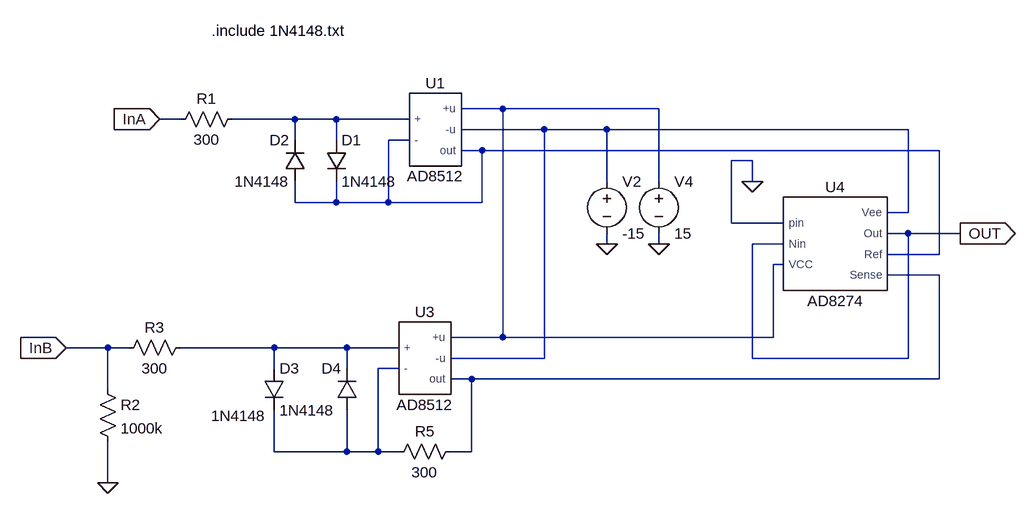
[diagram p0: schematic BufH.asc]
BufH.asc, the LTspice schematic file:
Version 4
SHEET 1 3012 1016
WIRE -256 -464 -320 -464
WIRE -16 -464 -256 -464
WIRE -752 -448 -784 -448
WIRE -576 -448 -672 -448
WIRE -512 -448 -576 -448
WIRE -400 -448 -512 -448
WIRE -192 -432 -320 -432
WIRE -96 -432 -192 -432
WIRE 368 -432 -96 -432
WIRE -576 -416 -576 -448
WIRE -512 -416 -512 -448
WIRE -400 -416 -432 -416
WIRE -288 -400 -320 -400
WIRE 416 -400 -288 -400
WIRE 128 -384 96 -384
WIRE -96 -352 -96 -432
WIRE -16 -352 -16 -464
WIRE 128 -352 128 -384
WIRE -576 -320 -576 -352
WIRE -512 -320 -512 -352
WIRE -512 -320 -576 -320
WIRE -432 -320 -432 -416
WIRE -432 -320 -512 -320
WIRE -288 -320 -288 -400
WIRE -288 -320 -432 -320
WIRE 368 -304 368 -432
WIRE 368 -304 336 -304
WIRE 96 -288 96 -384
WIRE 176 -288 96 -288
WIRE 368 -272 336 -272
WIRE 448 -272 368 -272
WIRE -96 -256 -96 -272
WIRE -16 -256 -16 -272
WIRE 176 -256 128 -256
WIRE 416 -240 416 -400
WIRE 416 -240 336 -240
WIRE 176 -224 160 -224
WIRE 416 -208 336 -208
WIRE -256 -112 -256 -464
WIRE -256 -112 -336 -112
WIRE 160 -112 160 -224
WIRE 160 -112 -256 -112
WIRE -864 -96 -928 -96
WIRE -832 -96 -864 -96
WIRE -608 -96 -752 -96
WIRE -496 -96 -608 -96
WIRE -416 -96 -496 -96
WIRE -192 -80 -192 -432
WIRE -192 -80 -336 -80
WIRE 128 -80 128 -256
WIRE 368 -80 368 -272
WIRE 368 -80 128 -80
WIRE -608 -64 -608 -96
WIRE -496 -64 -496 -96
WIRE -416 -64 -448 -64
WIRE -304 -48 -336 -48
WIRE 416 -48 416 -208
WIRE 416 -48 -304 -48
WIRE -864 -32 -864 -96
WIRE -608 64 -608 0
WIRE -496 64 -496 0
WIRE -496 64 -608 64
WIRE -448 64 -448 -64
WIRE -448 64 -496 64
WIRE -416 64 -448 64
WIRE -304 64 -304 -48
WIRE -304 64 -336 64
WIRE -864 112 -864 48
FLAG -96 -256 0
FLAG -16 -256 0
FLAG -784 -448 InA
IOPIN -784 -448 In
FLAG -928 -96 InB
IOPIN -928 -96 In
FLAG 448 -272 OUT
IOPIN 448 -272 Out
FLAG -864 112 0
FLAG 128 -352 0
SYMBOL AD8512 -368 -432 R0
SYMATTR InstName U1
SYMBOL voltage -16 -368 R0
WINDOW 123 0 0 Left 0
WINDOW 39 0 0 Left 0
SYMATTR InstName V4
SYMATTR Value 15
SYMBOL AD8512 -384 -80 R0
SYMATTR InstName U3
SYMBOL voltage -96 -368 R0
WINDOW 123 0 0 Left 0
WINDOW 39 0 0 Left 0
SYMATTR InstName V2
SYMATTR Value -15
SYMBOL AD8274 256 -256 R0
SYMATTR InstName U4
SYMBOL res -880 -48 R0
SYMATTR InstName R2
SYMATTR Value 1000k
SYMBOL res -656 -464 R90
WINDOW 0 0 56 VBottom 2
WINDOW 3 32 56 VTop 2
SYMATTR InstName R1
SYMATTR Value 300
SYMBOL res -736 -112 R90
WINDOW 0 0 56 VBottom 2
WINDOW 3 32 56 VTop 2
SYMATTR InstName R3
SYMATTR Value 300
SYMBOL diode -528 -416 R0
SYMATTR InstName D1
SYMATTR Value 1N4148
SYMBOL diode -560 -352 R180
WINDOW 0 24 64 Left 2
WINDOW 3 24 0 Left 2
SYMATTR InstName D2
SYMATTR Value 1N4148
SYMBOL diode -624 -64 R0
SYMATTR InstName D3
SYMATTR Value 1N4148
SYMBOL diode -480 0 R180
WINDOW 0 24 64 Left 2
WINDOW 3 140 -9 Left 2
SYMATTR InstName D4
SYMATTR Value 1N4148
SYMBOL res -320 48 R90
WINDOW 0 0 56 VBottom 2
WINDOW 3 32 56 VTop 2
SYMATTR InstName R5
SYMATTR Value 300
TEXT -704 -584 Left 2 !.include 1N4148.txt

The netlist it stands for:
* BufH.asc
XU1 N002 N004 N001 N003 N004 AD8512  ; pins + - +u -u out
V4 N001 0 15
XU3 N006 N007 N001 N003 N005 AD8512  ; pins + - +u -u out
V2 N003 0 -15
XU4 0 OUT N001 N003 OUT N004 N005 AD8274  ; pins pin Nin VCC Vee Out Ref Sense
R2 InB 0 1000k
R1 N002 InA 300
R3 N006 InB 300
D1 N002 N004 1N4148
D2 N004 N002 1N4148
D3 N006 N007 1N4148
D4 N007 N006 1N4148
R5 N005 N007 300
.model D D
.lib standard.dio
.include 1N4148.txt
.lib AD8512.cir
.lib AD8274.cir
.backanno
.end